# Altium schematic sheet ADC.SchDoc
size A4; SheetNumber: 2; SheetTotal: 5
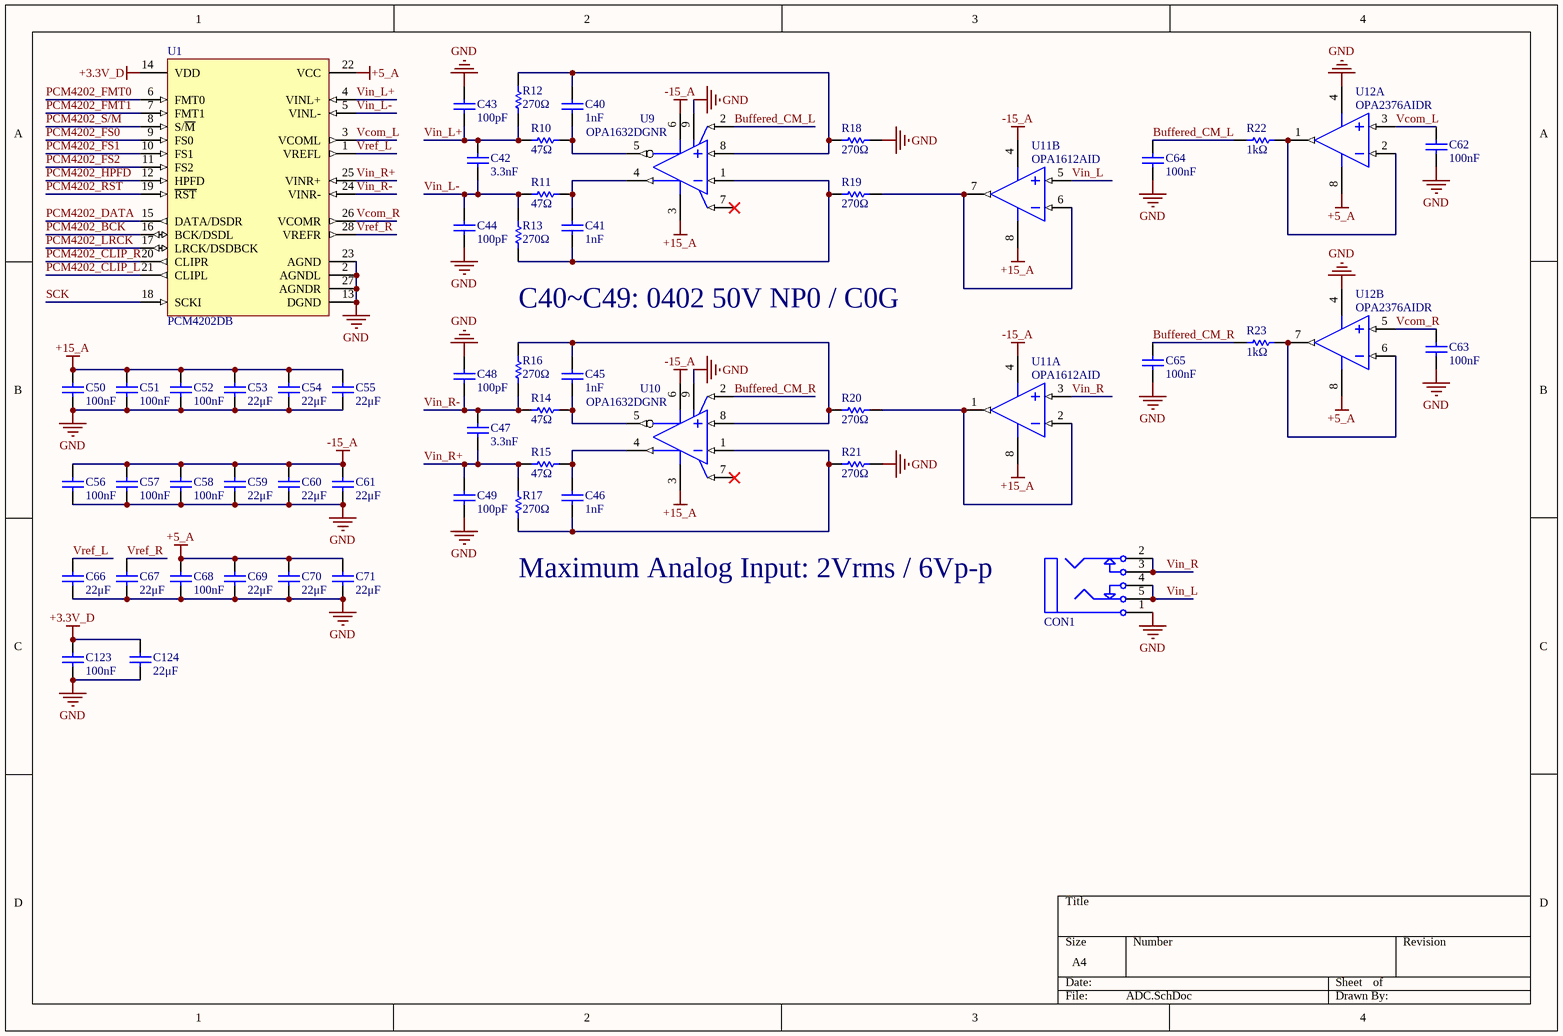
[diagram p0: ADC.SchDoc]

## Parts
C40  1nF  [C 0402_L]
C41  1nF  [C 0402_L]
C42  3.3nF  [C 0402_L]
C43  100pF  [C 0402_L]
C44  100pF  [C 0402_L]
C45  1nF  [C 0402_L]
C46  1nF  [C 0402_L]
C47  3.3nF  [C 0402_L]
C48  100pF  [C 0402_L]
C49  100pF  [C 0402_L]
C50  100nF  [C 0402_L]
C51  100nF  [C 0402_L]
C52  100nF  [C 0402_L]
C53  22μF  [0805_C]
C54  22μF  [0805_C]
C55  22μF  [0805_C]
C56  100nF  [C 0402_L]
C57  100nF  [C 0402_L]
C58  100nF  [C 0402_L]
C59  22μF  [0805_C]
C60  22μF  [0805_C]
C61  22μF  [0805_C]
C62  100nF  [C 0402_L]
C63  100nF  [C 0402_L]
C64  100nF  [C 0402_L]
C65  100nF  [C 0402_L]
C66  22μF  [0805_C]
C67  22μF  [0805_C]
C68  100nF  [C 0402_L]
C69  22μF  [0805_C]
C70  22μF  [0805_C]
C71  22μF  [0805_C]
C123  100nF  [C 0402_L]
C124  22μF  [0805_C]
CON1  3F07_BK  [3F07_PK]  (value not drawn)
R10  47Ω  [R 0402_L]
R11  47Ω  [R 0402_L]
R12  270Ω  [R 0402_L]
R13  270Ω  [R 0402_L]
R14  47Ω  [R 0402_L]
R15  47Ω  [R 0402_L]
R16  270Ω  [R 0402_L]
R17  270Ω  [R 0402_L]
R18  270Ω  [R 0402_L]
R19  270Ω  [R 0402_L]
R20  270Ω  [R 0402_L]
R21  270Ω  [R 0402_L]
R22  1kΩ  [R 0402_L]
R23  1kΩ  [R 0402_L]
U1  PCM4202DB  [SOP65P780X200-28N]
U9  OPA1632DGNR  [DGN0008D_L]
U10  OPA1632DGNR  [DGN0008D_L]
U11  OPA1612AID  [D0008A_L]  (parts A,B of 2)
U12  OPA2376AIDR  [D0008A_L]  (parts A,B of 2)

## Nets
+3.3V_D: C123.1 C124.1 U1.14(VDD)
+5_A: C68.1 C69.1 C70.1 C71.1 U1.22(VCC) U12.8(V+)
+15_A: C50.1 C51.1 C52.1 C53.1 C54.1 C55.1 U9.3(V+) U10.3(V+) U11.8(V+)
-15_A: C56.1 C57.1 C58.1 C59.1 C60.1 C61.1 U9.6(V-) U10.6(V-) U11.4(V-)
GND: C43.1 C44.2 C48.1 C49.2 C50.2 C51.2 C52.2 C53.2 C54.2 C55.2 C56.2 C57.2 C58.2 C59.2 C60.2 C61.2 C62.2 C63.2 C64.2 C65.2 C66.2 C67.2 C68.2 C69.2 C70.2 C71.2 C123.2 C124.2 CON1.1 R18.2 R21.2 U1.2(AGNDL) U1.13(DGND) U1.23(AGND) U1.27(AGNDR) U9.9(EP) U10.9(EP) U12.4(V-)
Buffered_CM_L: C64.1 R22.1 U9.2(VOCM)
Buffered_CM_R: C65.1 R23.1 U10.2(VOCM)
PCM4202_BCK: U1.16(BCK/DSDL)
PCM4202_CLIP_L: U1.21(CLIPL)
PCM4202_CLIP_R: U1.20(CLIPR)
PCM4202_DATA: U1.15(DATA/DSDR)
PCM4202_FMT0: U1.6(FMT0)
PCM4202_FMT1: U1.7(FMT1)
PCM4202_FS0: U1.9(FS0)
PCM4202_FS1: U1.10(FS1)
PCM4202_FS2: U1.11(FS2)
PCM4202_HPFD: U1.12(HPFD)
PCM4202_LRCK: U1.17(LRCK/DSDBCK)
PCM4202_~{RST}: U1.19(~{RST})
PCM4202_S/~{M}: U1.8(S/~{M})
SCK: U1.18(SCKI)
Vcom_L: C62.1 U1.3(VCOML) U12.3(IN_A+)
Vcom_R: C63.1 U1.26(VCOMR) U12.5(IN_B+)
Vin_L: CON1.4 CON1.5 U11.5(IN_B+)
Vin_L+: C42.1 C43.2 R10.2 R12.2 U1.4(VINL+)
Vin_L-: C42.2 C44.1 R11.2 R13.1 U1.5(VINL-)
Vin_R: CON1.2 CON1.3 U11.3(IN_A+)
Vin_R+: C47.2 C49.1 R15.2 R17.1 U1.25(VINR+)
Vin_R-: C47.1 C48.2 R14.2 R16.2 U1.24(VINR-)
Vref_L: C66.1 U1.1(VREFL)
Vref_R: C67.1 U1.28(VREFR)
NetC40_1: C40.1 R10.1 U9.5(VOUT-)
NetC40_2: C40.2 R12.1 R18.1 U9.8(VIN+)
NetC41_1: C41.1 R11.1 U9.4(VOUT+)
NetC41_2: C41.2 R13.2 R19.1 U9.1(VIN-)
NetC45_1: C45.1 R14.1 U10.5(VOUT-)
NetC45_2: C45.2 R16.1 R20.1 U10.8(VIN+)
NetC46_1: C46.1 R15.1 U10.4(VOUT+)
NetC46_2: C46.2 R17.2 R21.1 U10.1(VIN-)
NetR19_2: R19.2 U11.6(IN_B-) U11.7(OUT_B)
NetR20_2: R20.2 U11.1(OUT_A) U11.2(IN_A-)
NetR22_2: R22.2 U12.1(OUT_A) U12.2(IN_A-)
NetR23_2: R23.2 U12.6(IN_B-) U12.7(OUT_B)

Not connected (* = marked no-connect by the designer): U9 7(ENABLE)*; U10 7(ENABLE)*

## Notes on the sheet
- C40~C49: 0402 50V NP0 / C0G
- Maximum Analog Input: 2Vrms / 6Vp-p

## Library data of the parts
C40-C71 C123 C124 = Cap: Capacitor; Value: 10uF; Published: 8-Jun-2000; LatestRevisionDate: 17-Jul-2002; LatestRevisionNote: Re-released for DXP Platform.; PackageReference: RAD-0.3; Publisher: Altium Limited; PackageDescription: Radial Cap, Thru-Hole; 2 Leads; 0.3 in Pin Spacing
CON1 = 3F07: 3.5mm耳机插座; 淘宝ID: 小糖豆的小窝窝; BOM名称: 3.5mm耳机插座; 下单链接: https://item.taobao.com/item.htm?ft=t&id=613637044352
R10-R23 = Res1: Resistor; Value: 43K; Published: 8-Jun-2000; LatestRevisionDate: 17-Jul-2002; LatestRevisionNote: Re-released for DXP Platform.; PackageReference: AXIAL-0.3; Publisher: Altium Limited; PackageDescription: Axial Device, Thru-Hole; 2 Leads; 0.3 in Pin Spacing
U9 U10 = CMP-0808-00043-2: Fully Differential I/O Audio Amplifier, 5 to 32 V, -40 to 85 degC, 8-pin SOP (DGN8), Green (RoHS & no Sb/Br); Manufacturer: Texas Instruments; Number of Channels: 1; Vmax(V): 32; SubFamily: Audio Operational Amplifier; GBW(Typ)(MHz): 180; Iq per channel(Max)(mA): 17.1; Vmin(V): 5; Vn at Flatband(Typ)(nV/rtHz): 1.3; ComponentLink1URL: http://www.ti.com/; DatasheetVersion: SBOS286B; ComponentLink1Description: Manufacturer URL; PackageVersion: 4073271/F, 05/2011; PackageReference: DGN0008D; ComponentLink3URL: http://www.ti.com/litv/pdf/mpds046e; PackageDescription: 8-Pin Plastic Small Outline, Body 3 x 3 mm, Pitch 0.65 mm; Mounting Technology: Surface Mount; ComponentLink2Description: Datasheet; Code_JEDEC: MO-187; PartNumber: OPA1632DGNR; ComponentLink2URL: http://www.ti.com/general/docs/lit/getliterature.tsp?genericPartNumber=OPA1632&fileType=pdf; BW @ Acl(MHz): 180; Eco-Plan: Green (RoHS & no Sb/Br); ComponentLink3Description: Package Specification
U11 = CMP-0808-00013-2: 1.1 nV/rtHz Noise, Low Power, Precision Operational Amplifier, 4.5 to 36 V, -40 to 85 degC, 8-pin SOIC (D8), Green (RoHS & no Sb/Br); Manufacturer: Texas Instruments; Number of Channels: 2; Vmin(V): 4.5; Vmax(V): 36; SubFamily: Audio Operational Amplifier; Vn at Flatband(Typ)(nV/rtHz): 1.1; GBW(Typ)(MHz): 40; ComponentLink3URL: http://www.ti.com/litv/pdf/msoi002j; ComponentLink3Description: Package Specification; PartNumber: OPA1612AID; PackageVersion: 4040047-3/M, 06/2011; Code_JEDEC: MS-012; Eco-Plan: Green (RoHS & no Sb/Br); PackageReference: D0008A; ComponentLink1Description: Manufacturer URL; ComponentLink2URL: http://www.ti.com/general/docs/lit/getliterature.tsp?genericPartNumber=OPA1612&fileType=pdf; DatasheetVersion: SBOS450B; ComponentLink1URL: http://www.ti.com/; PackageDescription: 8-Pin Plastic Small Outline, Body 4.9 x 3.9 mm, Pitch 1.27 mm; Iq per channel(Max)(mA): 4.5; Mounting Technology: Surface Mount; ComponentLink2Description: Datasheet
U12 = CMP-0272-00809-3: Precision, Low Noise, Low Quiescent Current Operational Amplifier, 2 to 5.5 V, -40 to 125 degC, 8-pin SOIC (D8), Green (RoHS & no Sb/Br); Manufacturer: Texas Instruments; Total Supply Voltage(Min)(+5V is 5, +/-5V is 10): 2; Offset Drift(Typ)(uV/C): 0.32; IIB(Max)(pA): 10; CMRR(Min)(dB): 76; Iq per channel(Max)(mA): 0.95; Vio (25C)(Max)(mV): 0.025; Total Supply Voltage(Max)(+5V is 5, +/-5V is 10): 5.5; Sub Family: Low Input Bias Current Amp (<=10pA), Low Noise Amp (<=10nV/rtHz), Low Offset Voltage Amplifier (<=500uV), Low Supply Voltage Amplifier (<=2.7V), Precision Amplifier; Vn at 1kHz(Typ)(nV/rtHz): 7.5; PackageReference: D0008A; Eco-Plan: Green (RoHS & no Sb/Br); PackageVersion: 4040047-3/M, 06/2011; ComponentLink2Description: Datasheet; ComponentLink1URL: http://www.ti.com/; ComponentLink1Description: Manufacturer URL; Code_JEDEC: MS-012; ComponentLink2URL: http://www.ti.com/general/docs/lit/getliterature.tsp?genericPartNumber=OPA2376&fileType=pdf; Mounting Technology: Surface Mount; PartNumber: OPA2376AIDR; Slew Rate(Typ)(V/us): 2; Number of Channels: 2; ComponentLink3URL: http://www.ti.com/litv/pdf/msoi002j; ComponentLink3Description: Package Specification; DatasheetVersion: SBOS406F; PackageDescription: 8-Pin Plastic Small Outline, Body 4.9 x 3.9 mm, Pitch 1.27 mm
U1 = PCM4202DB: Package: None; Price: None; Value: *; MP: PCM4202DB; Availability: Unavailable